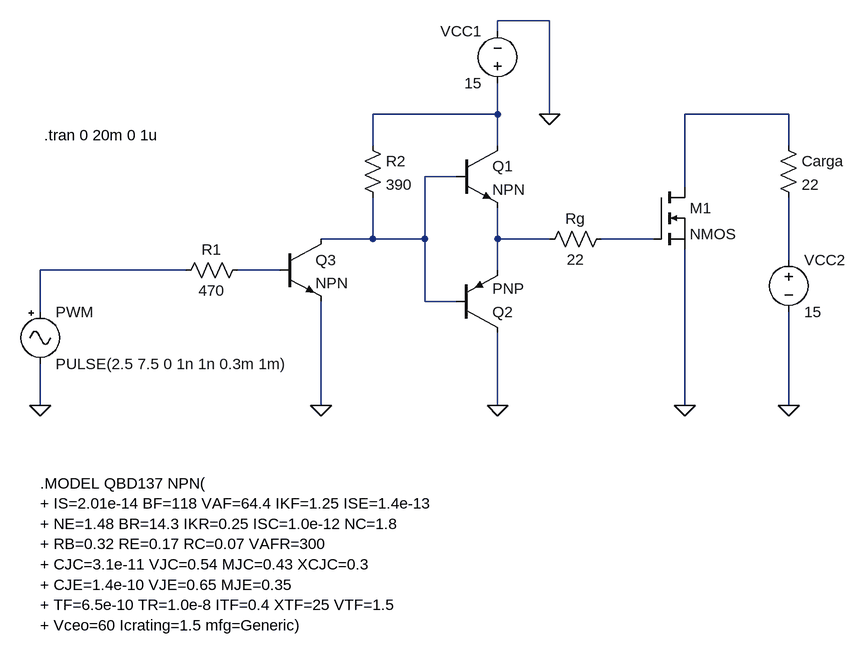
[diagram p0: schematic 1ideal.asc]
1ideal.asc, the LTspice schematic file:
Version 4
SHEET 1 880 780
WIRE 240 -144 160 -144
WIRE 160 -128 160 -144
WIRE 160 0 160 -48
WIRE 160 0 -32 0
WIRE 240 0 240 -144
WIRE 608 0 448 0
WIRE -32 48 -32 0
WIRE 160 48 160 0
WIRE 608 48 608 0
WIRE 96 96 48 96
WIRE 448 112 448 0
WIRE -32 192 -32 128
WIRE -32 192 -112 192
WIRE 48 192 48 96
WIRE 48 192 -32 192
WIRE 160 192 160 144
WIRE 240 192 160 192
WIRE 400 192 320 192
WIRE 608 224 608 128
WIRE -320 240 -544 240
WIRE -176 240 -240 240
WIRE 160 240 160 192
WIRE 48 288 48 192
WIRE 96 288 48 288
WIRE -544 304 -544 240
WIRE -544 448 -544 384
WIRE -112 448 -112 288
WIRE 160 448 160 336
WIRE 448 448 448 208
WIRE 608 448 608 304
FLAG 160 448 0
FLAG -112 448 0
FLAG 448 448 0
FLAG 240 0 0
FLAG 608 448 0
FLAG -544 448 0
SYMBOL npn 96 48 R0
SYMATTR InstName Q1
SYMBOL pnp 96 336 M180
SYMATTR InstName Q2
SYMBOL res -48 32 R0
SYMATTR InstName R2
SYMATTR Value 390
SYMBOL npn -176 192 R0
SYMATTR InstName Q3
SYMBOL res -224 224 R90
WINDOW 0 0 56 VBottom 2
WINDOW 3 32 56 VTop 2
SYMATTR InstName R1
SYMATTR Value 470
SYMBOL voltage 160 -32 R180
WINDOW 0 24 96 Left 2
WINDOW 3 24 16 Left 2
SYMATTR InstName VCC1
SYMATTR Value 15
SYMBOL res 336 176 R90
WINDOW 0 0 56 VBottom 2
WINDOW 3 32 56 VTop 2
SYMATTR InstName Rg
SYMATTR Value 22
SYMBOL nmos 400 112 R0
SYMATTR InstName M1
SYMBOL res 592 32 R0
SYMATTR InstName Carga
SYMATTR Value 22
SYMBOL voltage 608 208 R0
SYMATTR InstName VCC2
SYMATTR Value 15
SYMBOL Misc\\signal -544 288 R0
WINDOW 123 0 0 Left 0
WINDOW 39 0 0 Left 0
SYMATTR InstName PWM
SYMATTR Value PULSE(2.5 7.5 0 1n 1n 0.3m 1m)
TEXT -538 32 Left 2 !.tran 0 20m 0 1u
TEXT -544 568 Left 2 !.MODEL QBD137 NPN(\n+ IS=2.01e-14 BF=118 VAF=64.4 IKF=1.25 ISE=1.4e-13\n+ NE=1.48 BR=14.3 IKR=0.25 ISC=1.0e-12 NC=1.8\n+ RB=0.32 RE=0.17 RC=0.07 VAFR=300\n+ CJC=3.1e-11 VJC=0.54 MJC=0.43 XCJC=0.3\n+ CJE=1.4e-10 VJE=0.65 MJE=0.35\n+ TF=6.5e-10 TR=1.0e-8 ITF=0.4 XTF=25 VTF=1.5\n+ Vceo=60 Icrating=1.5 mfg=Generic)

The netlist it stands for:
* 1ideal.asc
Q1 N001 N003 N004 0 NPN
Q2 0 N003 N004 0 PNP
R2 N001 N003 390
Q3 N003 N008 0 0 NPN
R1 N008 N007 470
VCC1 N001 0 15
Rg N005 N004 22
M1 N002 N005 0 0 NMOS
R§Carga N002 N006 22
VCC2 N006 0 15
V§PWM N007 0 PULSE(2.5 7.5 0 1n 1n 0.3m 1m)
.model NPN NPN
.model PNP PNP
.lib standard.bjt
.model NMOS NMOS
.model PMOS PMOS
.lib standard.mos
.tran 0 20m 0 1u
.MODEL QBD137 NPN(
+ IS=2.01e-14 BF=118 VAF=64.4 IKF=1.25 ISE=1.4e-13
+ NE=1.48 BR=14.3 IKR=0.25 ISC=1.0e-12 NC=1.8
+ RB=0.32 RE=0.17 RC=0.07 VAFR=300
+ CJC=3.1e-11 VJC=0.54 MJC=0.43 XCJC=0.3
+ CJE=1.4e-10 VJE=0.65 MJE=0.35
+ TF=6.5e-10 TR=1.0e-8 ITF=0.4 XTF=25 VTF=1.5
+ Vceo=60 Icrating=1.5 mfg=Generic)
.backanno
.end